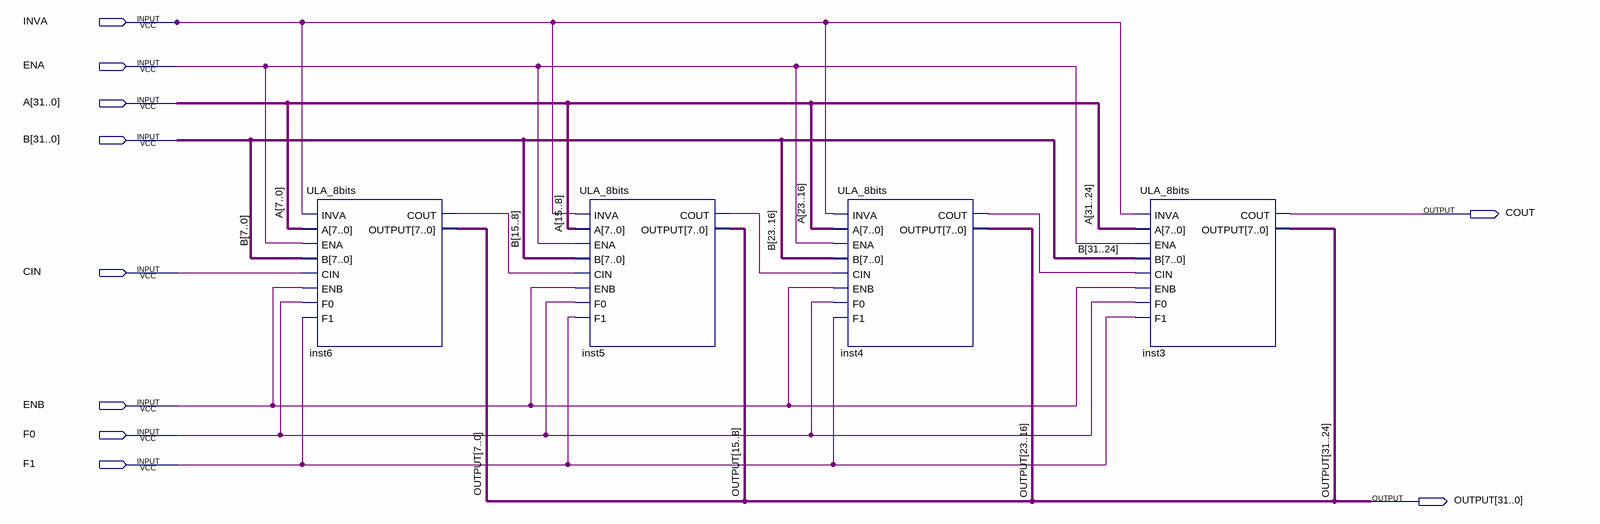
[diagram p0: schematic sheet]
// Quartus schematic ULA_32bits.bdf as structural Verilog: 4 symbols, 10 pins
module ULA_32bits (
  input  INVA,
  input  ENA,
  input  [31:0] A,
  input  [31:0] B,
  input  CIN,
  input  ENB,
  input  F0,
  input  F1,
  output COUT,
  output [31:0] OUTPUT
);

  wire inst4_cout, inst5_cout, inst6_cout;

  ULA_8bits inst6 (
    .INVA(INVA), .A(A[7:0]), .ENA(ENA), .B(B[7:0]), .CIN(CIN), .ENB(ENB), .F0(F0), .F1(F1),
    .COUT(inst6_cout), .OUTPUT(OUTPUT[7:0]));
  ULA_8bits inst5 (
    .INVA(INVA), .A(A[15:8]), .ENA(ENA), .B(B[15:8]), .CIN(inst6_cout), .ENB(ENB), .F0(F0), .F1(F1),
    .COUT(inst5_cout), .OUTPUT(OUTPUT[15:8]));
  ULA_8bits inst4 (
    .INVA(INVA), .A(A[23:16]), .ENA(ENA), .B(B[23:16]), .CIN(inst5_cout), .ENB(ENB), .F0(F0), .F1(F1),
    .COUT(inst4_cout), .OUTPUT(OUTPUT[23:16]));
  ULA_8bits inst3 (
    .INVA(INVA), .A(A[31:24]), .ENA(ENA), .B(B[31:24]), .CIN(inst4_cout), .ENB(ENB), .F0(F0), .F1(F1),
    .COUT(COUT), .OUTPUT(OUTPUT[31:24]));
endmodule
